# EAGLE design moduloCerradura (EAGLE 9.6.2)
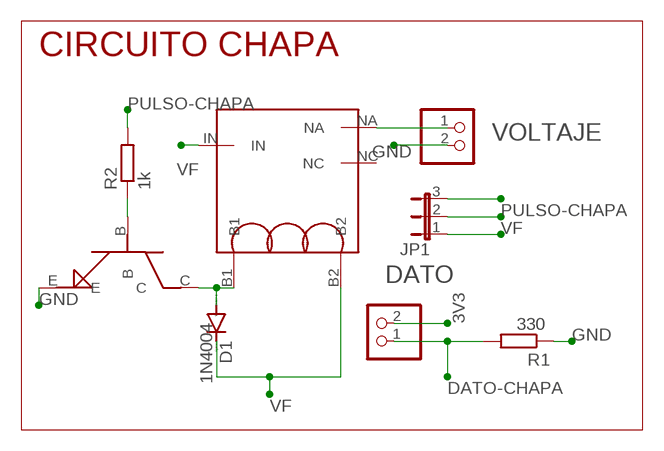
[diagram p0: schematic, sheet 1]

## Parts
D1  1N4004  [DO41-10]
DATO  PINHD-1X2  [1X02]
JP1  JP2E  [JP2]
R1  330  R-EU_0204/7  [0204/7]
R2  1k  R-EU_0204/7  [0204/7]
U$1  2N2222  [2N2222]
U$2  RELEY  [RELEY]
VOLTAJE  PINHD-1X2  [1X02]

## Nets
3V3: DATO.2
DATO-CHAPA: DATO.1 R1.2
GND: JP1.3 R1.1 U$1.E VOLTAJE.2
N$1: R2.1 U$1.B
N$2: D1.A U$1.C U$2.B1
N$3: U$2.NA VOLTAJE.1
PULSO-CHAPA: JP1.2 R2.2
VF: D1.C JP1.1 U$2.B2 U$2.IN
Unconnected: U$2.NC

## Notes on the sheet
- CIRCUITO CHAPA

## Library data of the parts
D1 = diode:1N4004: DIODE general purpose rectifier, 1 A
DATO VOLTAJE = pinhead:PINHD-1X2: PIN HEADER
JP1 = jumper:JP2E: JUMPER
R1 R2 = rcl:R-EU_: RESISTOR, European symbol; SPICEPREFIX: R
U$1 = MODULAR:2N2222
U$2 = MODULAR:RELEY

## Module MODULO_TEST
Ports: 

### Library data of the parts

## Board
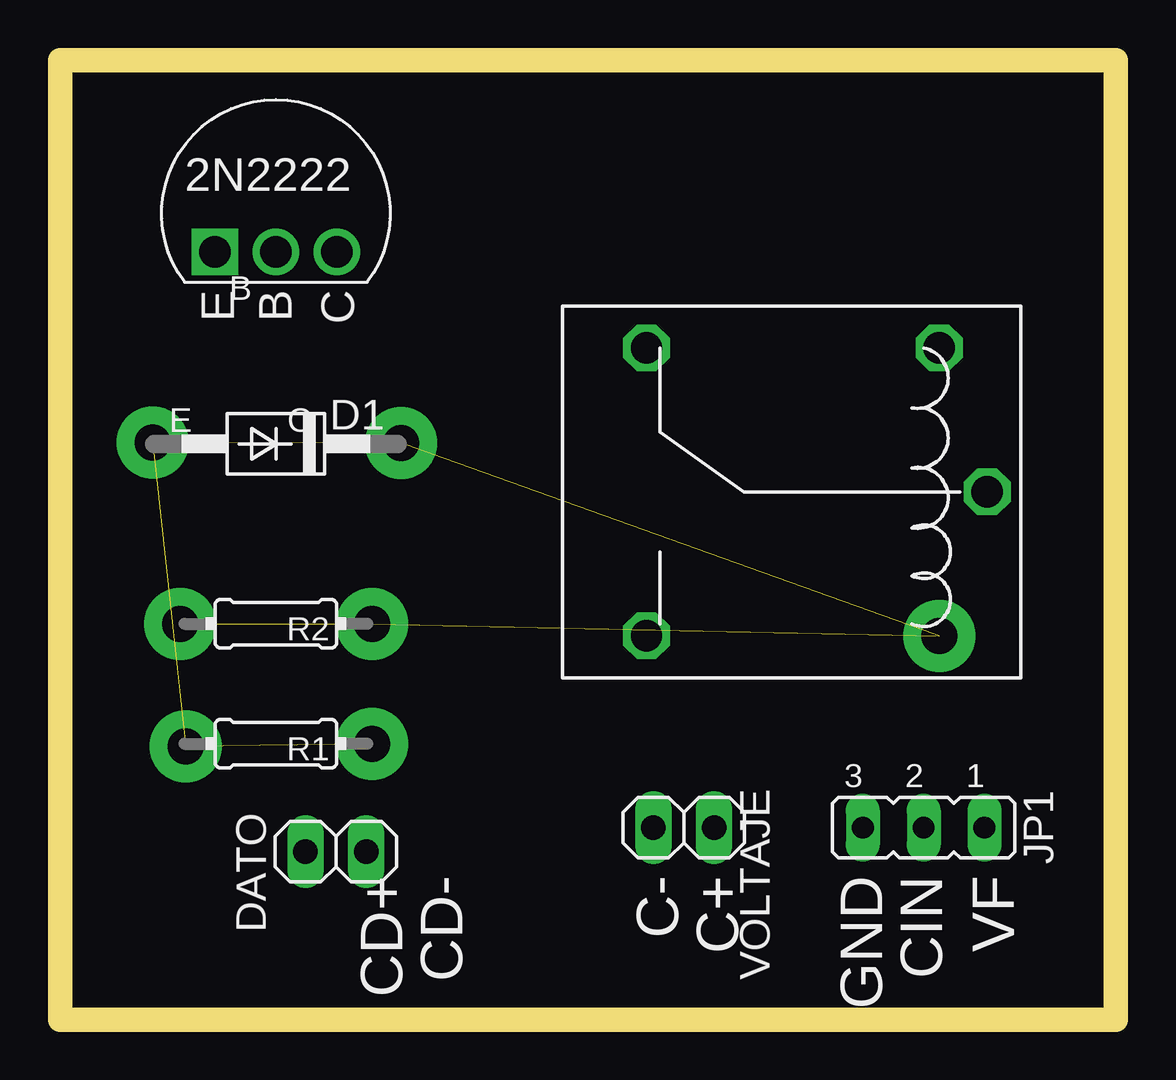
[diagram p1: board, top side]
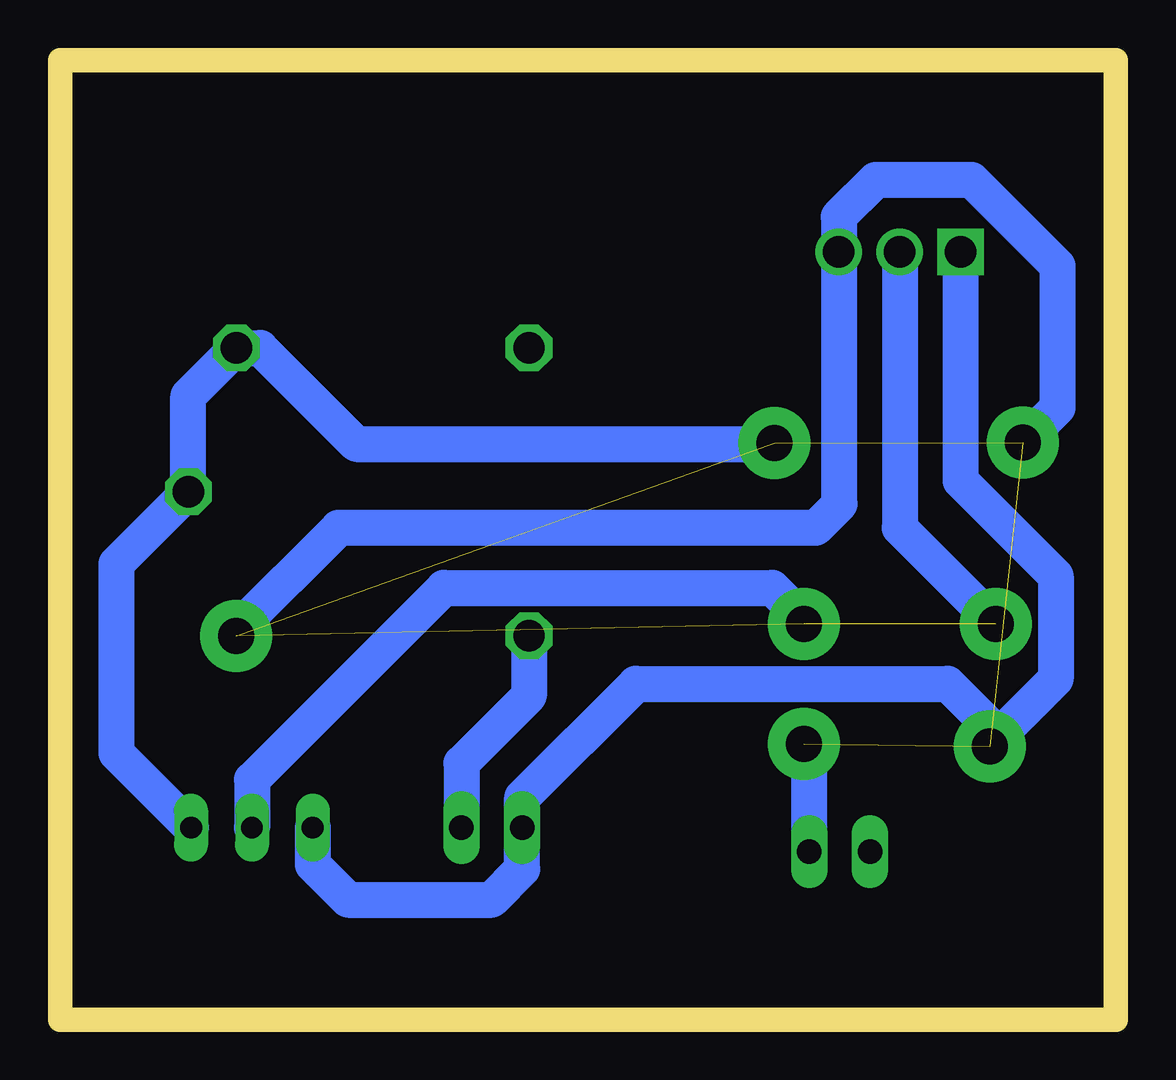
[diagram p2: board, bottom side, seen from below]

Size 44 x 40 mm. Coordinates in mm from the lower left corner, seen from the top.
Outline: 0,0 44,0 44,40 0,40 0,0
Copper layers (1*16): Top 0.035mm / dielectric 1.5mm / Bottom 0.035mm
Design rules "default": minimum track width 6mil, minimum drill 0.35mm, track to track 6mil, track to pad 6mil, pad to pad 6mil, via to via 6mil, smd to smd 6mil, copper to edge 40mil, drill to drill 6mil, minimum pad ring 10mil, minimum via ring 8mil, stop-mask expansion 4mil, vias tented up to drill 0mil, thermal gap 10mil

### Footprints (pad centres in the part's own frame; a part is rotated, then mirrored left to right if it is on the bottom)
DO41-10 = drill 1.118: A 5.08,0; C -5.08,0
1X02 = drill 1.016 long: 1 -1.27,0; 2 1.27,0
JP2 = drill 0.914 long: 1 -2.54,0; 2 0,0; 3 2.54,0
0204/7 = drill 0.813 octagon: 1 -3.81,0; 2 3.81,0
2N2222 = drill 1.3: B 0,0; C 2.54,0 | drill 1.3 square: E -2.54,0
RELEY = drill 1.3 octagon: B1 6,6.15; B2 -6,6.15; IN 0,8.15; NA 6,-6.05; NC -6,-6.05

### Placement (x,y rotation side)
D1  9,24 180 top
DATO  11.5,7 180 top
JP1  36,8 180 top
R1  9,11.5 0 top
R2  9,16.5 0 top
U$1  9,32 0 top
U$2  30.5,22 270 top
VOLTAJE  26,8 180 top

### Tracks (layer width: path | path; a pad name or v marks a point on that pad's centre or on a via)
DATO-CHAPA
  Bottom 0.152: 12.77,11.15 12.81,11.19
  Bottom 1.5: 12.81,11.19 R1.2 | DATO.1 12.77,11.15
GND
  Bottom 1.5: JP1.3 33.46,6.46 32,5 26,5 24.73,6.27 VOLTAJE.2 24.73,9.27 20,14 7,14 5.19,12.19 R1.1 2.5,14.19 2.5,18.5 6.46,22.46 U$1.E
N$1
  Bottom 1.5: R2.1 5.19,16.69 9,20.5 U$1.B
N$2
  Bottom 1.5: D1.A 2.42,25.5 2.42,31.42 6,35 10,35 11.54,33.46 U$1.C 11.54,21.54 11.5,21.5 12.5,20.5 32.39,20.5 36.65,16.24 U$2.B1
N$3
  Bottom 1.5: U$2.NA 24.45,13.5 27.27,10.68 VOLTAJE.1
N$4  (via drill 1.5 pad 3)  (6 unrouted)
  other vias: 3.86,24.06 14.22,24.04 13,11.5 5.24,11.38 36.66,16 13,16.5 5,16.5
PULSO-CHAPA
  Bottom 1.5: R2.2 14.31,18 28,18 36,10 JP1.2
VF
  Bottom 1.5: D1.C 31.65,24 35.65,28 U$2.B2 38.65,26 U$2.IN 41.65,19 41.65,11.11 JP1.1

### Text on the board
tPlace: B | E | C | CD+ | CD- | C- | C+ | GND | CIN | VF